# Altium schematic sheet 1.USB-TO-UART.SchDoc
size A4
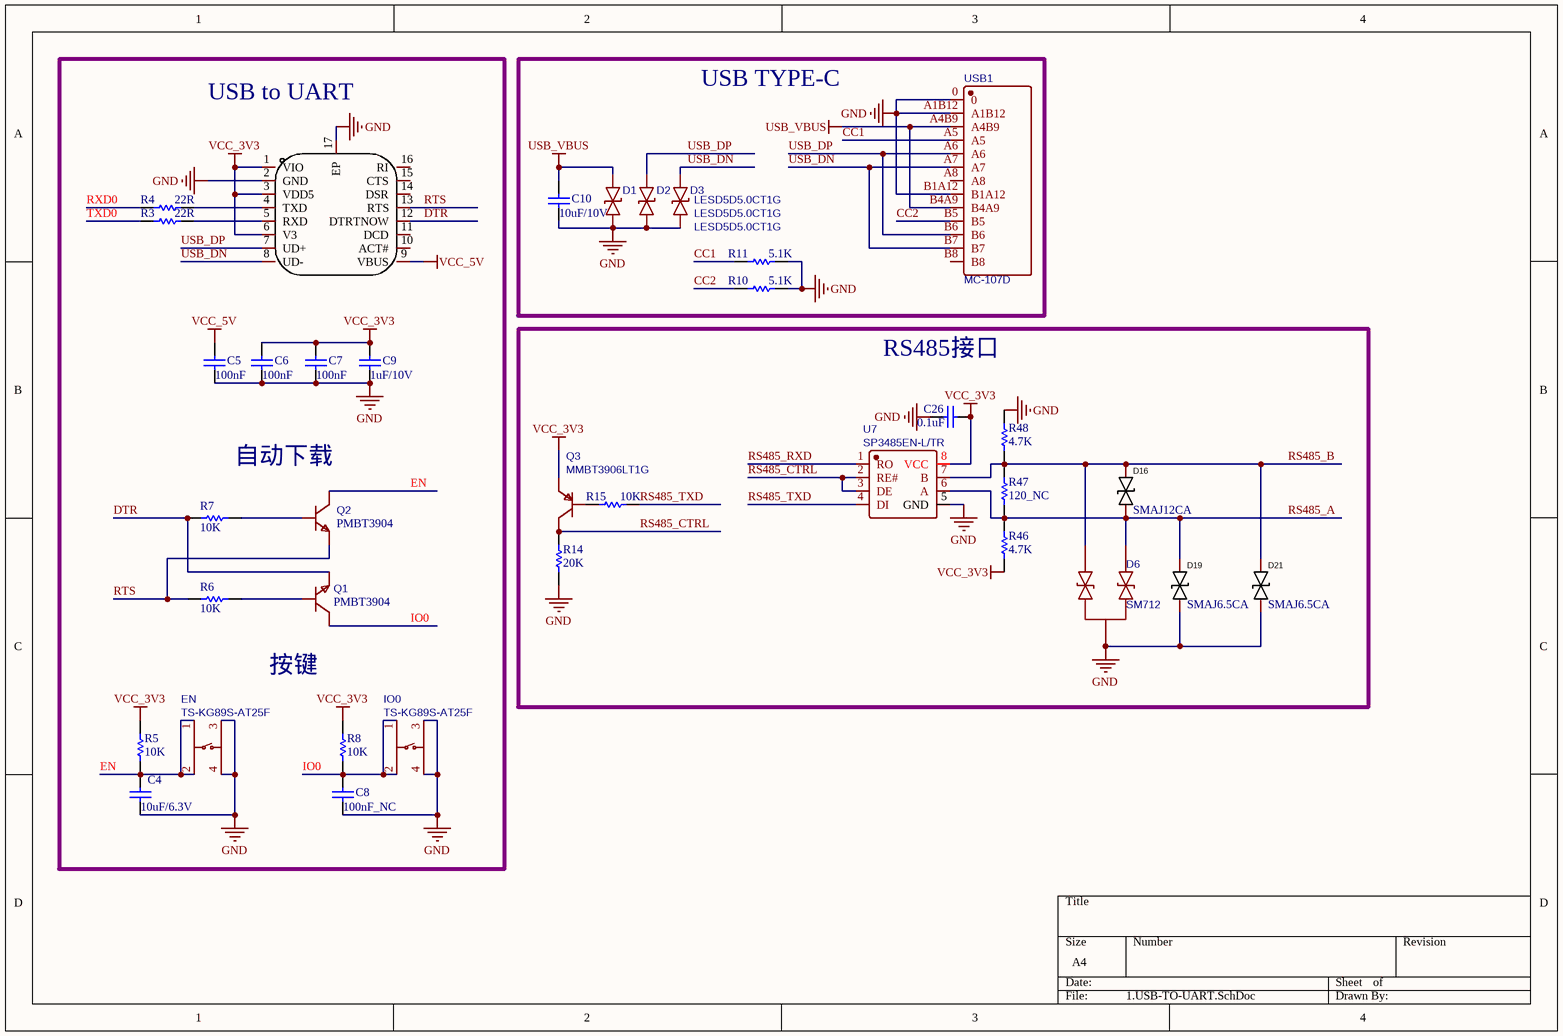
[diagram p0: 1.USB-TO-UART.SchDoc]

## Parts
C4  10uF/6.3V  [0402]
C5  100nF  [0402]
C6  100nF  [0402]
C7  100nF  [0402]
C8  100nF_NC  [0402]
C9  1uF/10V  [0402]
C10  10uF/10V  [0402]
C26  0.1uF  [0402]
D1  LESD5D5.0CT1G  [SOD-523_L1.2-W0.8-LS1.6-BI]
D2  LESD5D5.0CT1G  [SOD-523_L1.2-W0.8-LS1.6-BI]
D3  LESD5D5.0CT1G  [SOD-523_L1.2-W0.8-LS1.6-BI]
D6  SM712  [SOT-23-3_L2.9-W1.3-P1.90-LS2.4-BR]
D16  SMAJ12CA  [SMA_L4.3-W2.6-LS5.0-BI]
D19  SMAJ6.5CA  [SMA_L4.3-W2.6-LS5.0-BI]
D21  SMAJ6.5CA  [SMA_L4.3-W2.6-LS5.0-BI]
EN  TS-KG89S-AT25F  [SW-SMD_4P-L4.2-W3.3-P2.15-LS5.1]
IO0  TS-KG89S-AT25F  [SW-SMD_4P-L4.2-W3.3-P2.15-LS5.1]
Q1  PMBT3904  [SOT23]
Q2  PMBT3904  [SOT23]
Q3  MMBT3906LT1G  [SOT-23-3_L2.9-W1.3-P1.90-LS2.4-BR]
R3  22R  [0402]
R4  22R  [0402]
R5  10K  [0402]
R6  10K  [0402]
R7  10K  [0402]
R8  10K  [0402]
R10  5.1K  [0402]
R11  5.1K  [0402]
R14  20K  [0402]
R15  10K  [0402]
R46  4.7K  [0603]
R47  120_NC  [0603]
R48  4.7K  [0603]
U2  CH343P  [TQFN-16_L3.0-W3.0-P0.50-BL-EP1.7]  (value not drawn)
U7  SP3485EN-L/TR  [SOIC8]
USB1  MC-107D  [USB-C-SMD_MC-107D]

## Blocks framed on the sheet
USB TYPE-C: C10 D1-D3 R10 R11 USB1
RS485接口: C26 D6 D16 D19 D21 Q3 R14 R15 R46-R48 U7

## Nets
GND: C4.2 C5.1 C6.1 C7.1 C8.1 C9.1 C10.1 C26.1 D1.1 D2.1 D3.1 D6.3 D19.1 D21.1 EN.3 EN.4 IO0.3 IO0.4 R10.1 R11.1 R14.2 R48.2 U2.2(GND) U2.17(EP) U7.5(GND) USB1.0 USB1.A1B12 USB1.B1A12
USB_VBUS: C10.2 D1.2 USB1.A4B9 USB1.B4A9
VCC_3V3: C6.2 C7.2 C9.2 C26.2 Q3.2(E) R5.2 R8.2 R46.1 U2.1(VIO) U2.3(VDD5) U2.6(V3) U7.8(VCC)
VCC_5V: C5.2 U2.9(VBUS)
CC1: R11.2 USB1.A5
CC2: R10.2 USB1.B5
DTR: Q1.2(E) R7.1 U2.12(DTRTNOW)
EN: C4.1 EN.1 EN.2 Q2.3(C) R5.1
IO0: C8.2 IO0.1 IO0.2 Q1.3(C) R8.1
RS485_A: D6.1 D16.1 D19.2 R46.2 R47.1 U7.6(A)
RS485_B: D6.2 D16.2 D21.2 R47.2 R48.1 U7.7(B)
RS485_CTRL: Q3.3(C) R14.1 U7.2(RE#) U7.3(DE)
RS485_RXD: U7.1(RO)
RS485_TXD: R15.1 U7.4(DI)
RTS: Q2.2(E) R6.1 U2.13(RTS)
RXD0: R4.2
TXD0: R3.2
USB_DN: D3.2 U2.8(UD-) USB1.A7 USB1.B7
USB_DP: D2.2 U2.7(UD+) USB1.A6 USB1.B6
NetQ1_1: Q1.1(B) R6.2
NetQ2_1: Q2.1(B) R7.2
NetQ3_1: Q3.1(B) R15.2
NetR3_1: R3.1 U2.5(RXD)
NetR4_1: R4.1 U2.4(TXD)

Not connected (* = marked no-connect by the designer): U2 10(ACT#) 11(DCD) 14(DSR) 15(CTS) 16(RI); USB1 A8 B8

## Notes on the sheet
- (near U2) USB to UART
- 自动下载
- 按键

## Library data of the parts
C4-C10 C26 = Cap: Capacitor; PartNumber: CAP100NF; Published: 8-Jun-2000; LatestRevisionDate: 17-Jul-2002; LatestRevisionNote: Re-released for DXP Platform.; PackageReference: 0402; Publisher: Altium Limited
  C4: Value: 10uF/6.3V
  C5-C7: Value: 100nF
  C8: Value: 100nF_NC
  C9: Value: 1uF/10V
  C10: Value: 10uF/10V
  C26: Value: 0.1uF
D1-D3 = LESD5D5.0CT1G: BOM_Manufacturer: Leshan Radio; Contributor: LCSC; BOM_Supplier: LCSC; BOM_Supplier Part: C383211; BOM_Manufacturer Part: LESD5D5.0CT1G; BOM_JLCPCB Part Class: Extended Part; spicePre: D; spiceSymbolName: LESD5D5.0CT1G
D6 = SM712_C521963: BOM_Manufacturer: TECH PUBLIC; Contributor: LCSC; BOM_Supplier: LCSC; BOM_Supplier Part: C7420375; BOM_Manufacturer Part: SM712; BOM_JLCPCB Part Class: Extended Part; spicePre: D; spiceSymbolName: SM712_C521963
D16 D19 D21 = SMAJ15CA_C223985: Add into BOM: yes; Reverse Stand-Off Voltage (Vrwm): 15V; Breakdown Voltage: 16.7V; Maximum Clamping Voltage: 24.4V; Name: =Manufacturer Part; Supplier Footprint: SMA(DO-214AC); JLCPCB Part Class: Extended Part; Datasheet: https://atta.szlcsc.com/upload/public/pdf/source/20180803/C223985_64CE82AFF6455DB84DF7C89EB213FBC9.pdf; Supplier: LCSC; Convert to PCB: yes
  D16: Supplier Part: C353487
  D19 D21: Supplier Part: C110041
EN IO0 = TS-KG89S-AT25F: Contributor: LCSC; BOM_Supplier: LCSC; BOM_Supplier Part: C2874599; BOM_Manufacturer Part: TS-KG89S-AT25F; BOM_JLCPCB Part Class: Extended Part; spicePre: S; spiceSymbolName: TS-KG89S-AT25F
Q1 Q2 = BC847_C475630: BOM_Manufacturer: Shikues; spicePre: Q; Value: PMBT3904
Q3 = S8550_C545533: Contributor: LCSC; BOM_Supplier: LCSC; BOM_Supplier Part: C53444; BOM_Manufacturer Part: MMBT3906LT1G; BOM_JLCPCB Part Class: Extended Part; spicePre: Q; spiceSymbolName: MMBT3906LT1G
R3 R4 R46-R48 = Res1: Resistor; PartNumber: RES22R; Published: 8-Jun-2000; LatestRevisionDate: 17-Jul-2002; LatestRevisionNote: Re-released for DXP Platform.; PackageReference: 0402; Publisher: Altium Limited
  R3 R4: Value: 22R
  R46 R48: Value: 4.7K
  R47: Value: 120_NC
R5-R8 R10 R11 R14 R15 = Res1: Resistor; PartNumber: RES2.2K; Published: 8-Jun-2000; LatestRevisionDate: 17-Jul-2002; LatestRevisionNote: Re-released for DXP Platform.; PackageReference: 0402; Publisher: Altium Limited
  R5-R8 R15: Value: 10K
  R10 R11: Value: 5.1K
  R14: Value: 20K
U2 = CH343P: Add into BOM: yes; Name: CH343P; Symbol: CH343P; Device: CH343P; LCSC Part Name: CH343P; Supplier Part: C2846043; Manufacturer Part: CH343P; Supplier Footprint: QFN-16; JLCPCB Part Class: Extended Part; Datasheet: https://atta.szlcsc.com/upload/public/pdf/source/20211010/C2846043_7FA705E1F14A2906F6A2AFA45FA28209.pdf; Supplier: LCSC; Convert to PCB: yes; Type: -; Protocol: -; Number of Drivers/Receivers: -; Data Rate: -; Supply Voltage: -
U7 = SP3485EN-L/TR: BOM_Manufacturer: EXAR; SMT Type: Basic; BOM_Supplier: LCSC; BOM_Manufacturer Part: SP3485EN-L/TR; BOM_LCSC Assembly: Yes; image: //image.lceda.cn/szlcsc/C8963.jpg; BOM_Supplier Part: C8963; spicePre: U; spiceSymbolName: SP3485EN-L/TR
USB1 = MC-107D: Contributor: LCSC; BOM_Supplier: LCSC; BOM_Supplier Part: C2874568; BOM_Manufacturer Part: MC-107D; BOM_JLCPCB Part Class: Extended Part; spicePre: U; spiceSymbolName: MC-107D